# Altium schematic sheet 3V3Secondary.SchDoc
size A; SheetNumber: 7; SheetTotal: 13
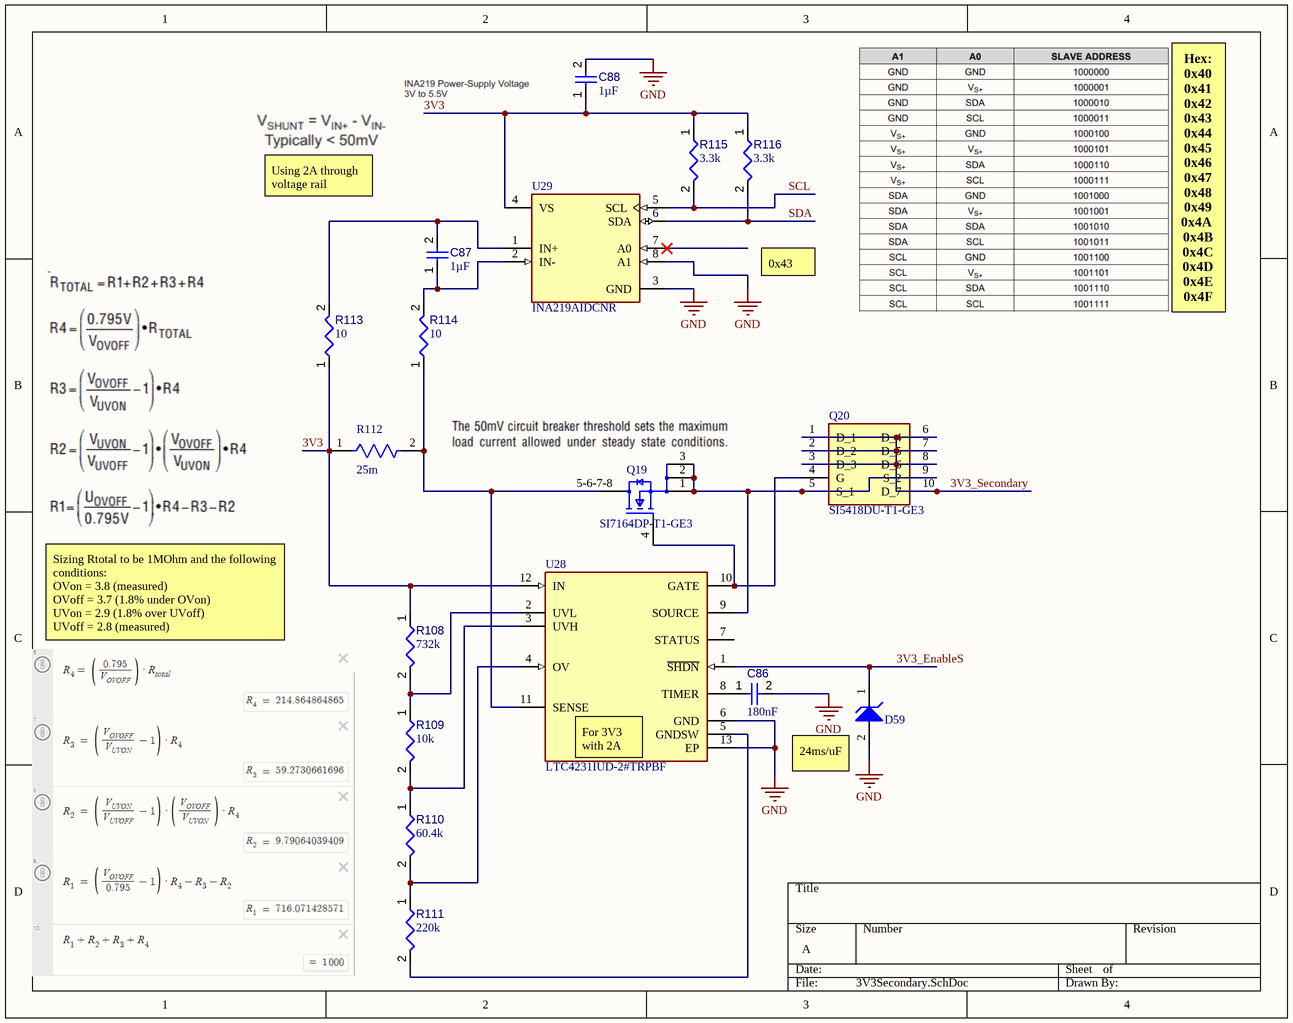
[diagram p0: 3V3Secondary.SchDoc]

## Parts
C86  value 180nF  [FP-C0805C-DN-IPC_A]  (hidden comment: C0805C184K5RACTU)
C87  value 1µF  [CAPC1608X90X40LL10T20]  (hidden comment: Capacitor 1 uF +/- 10% 25 V 0603)
C88  value 1µF  [CAPC1608X90X35ML15T15]  (hidden comment: Capacitor 1uF +/- 10% 16V 0603)
D59  MM3Z3V6T1G  [ONSC-SOD-323-2-477-02_V]  (value not drawn)
Q19  SI7164DP-T1-GE3  [Vishay_S17-0173-SINGLE_MFG]
Q20  SI5418DU-T1-GE3  [SI5418DU-T1-GE3-Footprint-1]
R108  value 732k  [FP-CR0805-IPC_A]  (hidden comment: CR0805-FX-7323ELF)
R109  value 10k  [RESC1005X40X25ML05T05]  (hidden comment: Resistor 10k +/-1% 0402 100 mW)
R110  value 60.4k  [RESC1005X40X25NL05T10]  (hidden comment: RC0402FR-0760K4L)
R111  value 220k  [FP-ESR01-IPC_C]  (hidden comment: ESR01MZPJ224)
R112  Resistance: 25m  [FP-CSR1206-IPC_C]  (hidden comment: CSR1206FK25L0)
R113  value 10  [RESC0402(1005)_L]  (hidden comment: Resistor 10R  +/-1 % 0402 63 mW)
R114  value 10  [RESC0402(1005)_L]  (hidden comment: Resistor 10R  +/-1 % 0402 63 mW)
R115  value 3.3k  [FP-CRCW1210-e3-IPC_C]  (hidden comment: CRCW12103K30JNEA)
R116  value 3.3k  [FP-CRCW1210-e3-IPC_C]  (hidden comment: CRCW12103K30JNEA)
U28  LTC4231IUD-2#TRPBF  [FP-UD-12-05-08-1855-IPC_A]
U29  INA219AIDCNR  [FP-DCN0008A-IPC_A]

## Nets
GND: C86.2 C88.2 D59.2(A) U28.6(GND) U28.13(EP) U29.3(GND) U29.8(A1)
3V3: C88.1 R108.1 R112.1 R113.1 R115.1 R116.1 U28.12(IN) U29.4(VS)
3V3_EnableS: D59.1(K) U28.1(~{SHDN})
3V3_Secondary: Q20.1(D_1) Q20.2(D_2) Q20.3(D_3) Q20.6(D_4) Q20.7(D_5) Q20.8(D_6) Q20.10(D_7)
SCL: R115.2 U29.5(SCL)
SDA: R116.2 U29.6(SDA)
NetC86_1: C86.1 U28.8(TIMER)
NetC87_1: C87.1 R114.2 U29.2(IN-)
NetC87_2: C87.2 R113.2 U29.1(IN+)
NetQ19_1: Q19.1(S) Q19.2(S) Q19.3(S) Q20.5(S_1) Q20.9(S_2) U28.9(SOURCE)
NetQ19_4: Q19.4(G) Q20.4(G) U28.10(GATE)
NetQ19_5-6-7-8: Q19.5-6-7-8(D) R112.2 R114.1 U28.11(SENSE)
NetR108_2: R108.2 R109.1 U28.2(UVL)
NetR109_2: R109.2 R110.1 U28.3(UVH)
NetR110_2: R110.2 R111.1 U28.4(OV)
NetR111_2: R111.2 U28.5(GNDSW)

Not connected (* = marked no-connect by the designer): U28 7(STATUS); U29 7(A0)*

## Notes on the sheet
- Using 2A through voltage rail
- 0x43
- Hex:
  0x40
  0x41
  0x42
  0x43
  0x44
  0x45
  0x46
  0x47
  0x48
  0x49
  0x4A
  0x4B
  0x4C
  0x4D
  0x4E
  0x4F
- Sizing Rtotal to be 1MOhm and the following conditions:
  OVon = 3.8 (measured)
  OVoff = 3.7 (1.8% under OVon)
  UVon = 2.9 (1.8% over UVoff)
  UVoff = 2.8 (measured)
- (near U28) For 3V3
  with 2A
- (near D59) 24ms/uF

## Library data of the parts
C86 = CMP-001-00086-1: Ceramic Capacitor, Multilayer, Ceramic, 50V, 10% +Tol, 10% -Tol, X7R, 15% TC, 0.18uF, Surface Mount, 0805; Capacitor Type: Ceramic; Mounting Technology: Surface Mount; Pins: 2; Min Operating Temperature: -55°C; Case/Package: 0805; Max Operating Temperature: 125°C; RoHS Compliant: Yes
C87 = CMP-001-00005-6: Chip Capacitor, 1 uF, +/- 10%, 25 V, 0603 (1608 Metric); Capacitor Type: Ceramic; Voltage Rating: 25V; Pins: 2; Mounting Technology: SM; RoHS Compliant: True; Max Operating Temperature: 125°C; Case/Package: 0603; Min Operating Temperature: -55°C; Tolerance: 10%
C88 = CMP-001-00004-6: Chip Capacitor, 1 uF, +/- 10%, 16 V, 0603 (1608 Metric); Capacitor Type: Ceramic; Mounting Technology: SM; RoHS Compliant: True; Min Operating Temperature: -55°C; Case/Package: 0603; Pins: 2; Voltage Rating: 16V; Max Operating Temperature: 125°C; Tolerance: 10%
D59 = CMP-1060-00650-1: Zener Voltage Regulator, 300 mW, 2-Pin SOD-323, Pb-Free, Tape and Reel; Manufacturer: On Semiconductor; VZ Typ (V): 3.6; P Max (W): 0.3; RoHS: Pb-Free; ComponentLink1URL: http://www.onsemi.com/; PackageVersion: Rev. H, 03/2007; PartNumber: MM3Z3V6T1G; ComponentLink2Description: Datasheet; ComponentLink2URL: http://www.onsemi.cn/pub_link/Collateral/MM3Z2V4T1-D.PDF; DatasheetVersion: Rev. 9; PackageReference: SOD-323-2-477-02; ComponentLink3URL: http://www.onsemi.com/pub_link/Collateral/477-02.PDF.1; Packing: Tape and Reel; Mounting Technology: Surface Mount; ComponentLink3Description: Package Specification; PackageDescription: 2-Pin SOD, Body 1.7 x 1.25 mm; ComponentLink1Description: Manufacturer URL
Q19 = CMP-013-00040-1: Power Field-Effect Transistor, 23.5A I(D), 60V, 0.00625ohm, 1-Element, N-Channel, Silicon, Metal-oxide Semiconductor FET; Pins: 5; RoHS Compliant: Yes; Max Operating Temperature: 150°C
Q20 = CMP-013-00041-1: Power Field-Effect Transistor, 11.6A I(D), 30V, 0.0145ohm, 1-Element, N-Channel, Silicon, Metal-oxide Semiconductor FET; Max Operating Temperature: 150°C; RoHS Compliant: Yes; Pins: 3
R108 = CMP-009-00197-1: Fixed Resistor, Metal Glaze/thick Film, 0.125W, 732000ohm, 150V, 1% +/-Tol, 100ppm/Cel, Surface Mount, 0805; Power: 125mW; Case/Package: 0805; RoHS Compliant: Yes; Min Operating Temperature: -55°C; Max Operating Temperature: 155°C; Mounting Technology: Surface Mount; Pins: 2; Tolerance: 1%
R109 = CMP-009-00015-5: Chip Resistor, 10 KOhm, +/- 1%, 0.1 W, -55 to 155 degC, 0402 (1005 Metric); Voltage Rating: 50V; Power: 100mW; Case/Package: 0402; RoHS Compliant: True; Min Operating Temperature: -55°C; Mounting Technology: SM; Tolerance: 1%; Max Operating Temperature: 155°C; Pins: 2
R110 = CMP-009-00202-1: Fixed Resistor, Metal Glaze/thick Film, 0.0625W, 60400ohm, 50V, 1% +/-Tol, 100ppm/Cel, Surface Mount, 0402; Power: 62.5mW; Case/Package: 0402; Tolerance: 1%; RoHS Compliant: Yes; Max Operating Temperature: 155°C; Pins: 2; Mounting Technology: Surface Mount; Min Operating Temperature: -55°C
R111 = CMP-009-00204-1: Fixed Resistor, Metal Glaze/thick Film, 0.2W, 220000ohm, 50V, 5% +/-Tol, 200ppm/Cel, Surface Mount, 0402; Power: 200mW; Max Operating Temperature: 155°C; Tolerance: 5%; RoHS Compliant: Yes; Pins: 2; Mounting Technology: Surface Mount; Case/Package: 0402; Min Operating Temperature: -55°C
R112 = CMP-26527-000133-1: General Purpose Thick Film Chip Resistor, 1206, 25mΩ, 1%, 0.5W; Max Power Dissipation: 500mW; Temperature Coefficient: 100ppm/°C; Lead Free: Lead Free; Military Standard: Not; Case Code (Imperial): 1206; Max Operating Temperature: 155°C; Case Code (Metric): 3216; Height: 0.026inch; Packaging: Tape and Reel; Case/Package: 1206; Series: CSR; Number of Terminations: 2; RoHS Compliant: Yes; Mount: Surface Mount; Depth: 1.55mm; Contact Plating: Tin; Length: 0.12inch; Radiation Hardening: No; Width: 0.061inch; Size Code: 1206; Power Rating: 500mW; Min Operating Temperature: -55°C; Tolerance: 1%; Resistor Type: Thick Film; Construction: Rectangular
R113 R114 = CMP-009-00152-3: Chip Resistor, 10 Ohms, +/-1 %, 63 mW, -55 to 155 degC, 0402; Tolerance: 1%; Power: 63mW; Pins: 2; Max Operating Temperature: 155°C; Min Operating Temperature: -55°C; Case/Package: 0402
R115 R116 = CMP-009-00192-1: Fixed Resistor, Metal Glaze/thick Film, 0.5W, 3300ohm, 200V, 5% +/-Tol, 200ppm/Cel, Surface Mount, 1210; Power: 500mW; RoHS Compliant: Yes; Max Operating Temperature: 155°C; Case/Package: 1210; Min Operating Temperature: -55°C; Mounting Technology: Surface Mount; Tolerance: 5%; Pins: 2
U28 = CMP-019-00049-1: Switching Controller, CMOS, PQCC12; Max Supply Voltage: 36V; Pins: 12; Min Operating Temperature: -40°C; Case/Package: HVQCCN; RoHS Compliant: Yes; Max Operating Temperature: 85°C
U29 = CMP-010-00025-1: Power Supply Support Circuit, Fixed, 2 Channel, 2V, PDSO8; Nominal Supply Voltage: 3.3V; Max Supply Voltage: 5.5V; Min Supply Voltage: 3V; Case/Package: LSSOP; Max Operating Temperature: 125°C; Min Operating Temperature: -40°C; Pins: 8; RoHS Compliant: Yes